# Altium schematic sheet CurrentSense.SchDoc
size A; SheetNumber: 8
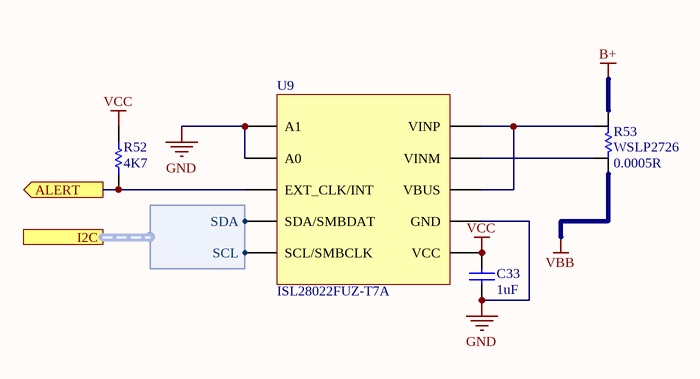
[diagram p0: CurrentSense.SchDoc]

## Parts
C33  value 1uF  [C0603[1608X92]]  (hidden comment: 1uF 6.3V 0603)
R52  value 4K7  [R0603[1608]]  (hidden comment: 4K7 1% 0603)
R53  WSLP2726  value 0.0005R  [WSL2726]
U9  ISL28022FUZ-T7A  [MSOP-10]

## Ports
ALERT (out), I2C (harness I2C)

## Harnesses
I2C: SCL, SDA

## Nets
B+: R53.2
GND: C33.1 U9.1(A1) U9.2(A0) U9.7(GND)
VBB: R53.1
VCC: C33.2 R52.2 U9.6(VCC)
ALERT: R52.1 U9.3(EXT_CLK/INT) ; port ALERT
NetR53_3: R53.3 U9.9(VINM)
NetR53_4: R53.4 U9.8(VBUS) U9.10(VINP)
NetU9_4: U9.4(SDA/SMBDAT) ; port I2C.SDA
NetU9_5: U9.5(SCL/SMBCLK) ; port I2C.SCL

## Library data of the parts
C33 = CAP_1uF_6.3V_0603_10%: 1uF 6.3V 10% 0603 (1608 Metric); PartNumber: GRM188R60J105KA01D; Manufacturer: Murata; TemperatureCoefficient: X5R; Mounting Technology: Surface Mount; PackageReference: 0603; PackageDescription: 0603 (1608 Metric); Voltage: 6.3V; Tolerance: 10%
R52 = RES_4K7_0603_1%: 4K7 0.25W 1% 0603 (1005 Metric); Manufacturer: Vishay / Dale; PartNumber: CRCW06034K70FKEAHP; Tolerance: 1%; Power: 0.25W; Mounting Technology: Surface Mount; PackageReference: 0603; PackageDescription: 0603 (1608 Metric); ComponentLink1Description: Datasheet; ComponentLink1URL: http://www.vishay.com/docs/20043/crcwhpe3.pdf
R53 = WSLP2726: Current Sense Resistor, 0.0005R; PartNumber: WSLP2726L5000FEA; Manufacturer: Vishay / Dale; Power: 7W; Tolerance: 1%; PackageReference: 2726; Mounting Technology: Surface Mount
U9 = ISL28022FUZ-T7A: Manufacturer: Intersil; PartNumber: ISL28022FUZ-T7A; Mounting Technology: Surface Mount; PackageReference: MSOP-10